# Altium schematic sheet 5V_REG.SchDoc
size A4; SheetNumber: 2; SheetTotal: 7
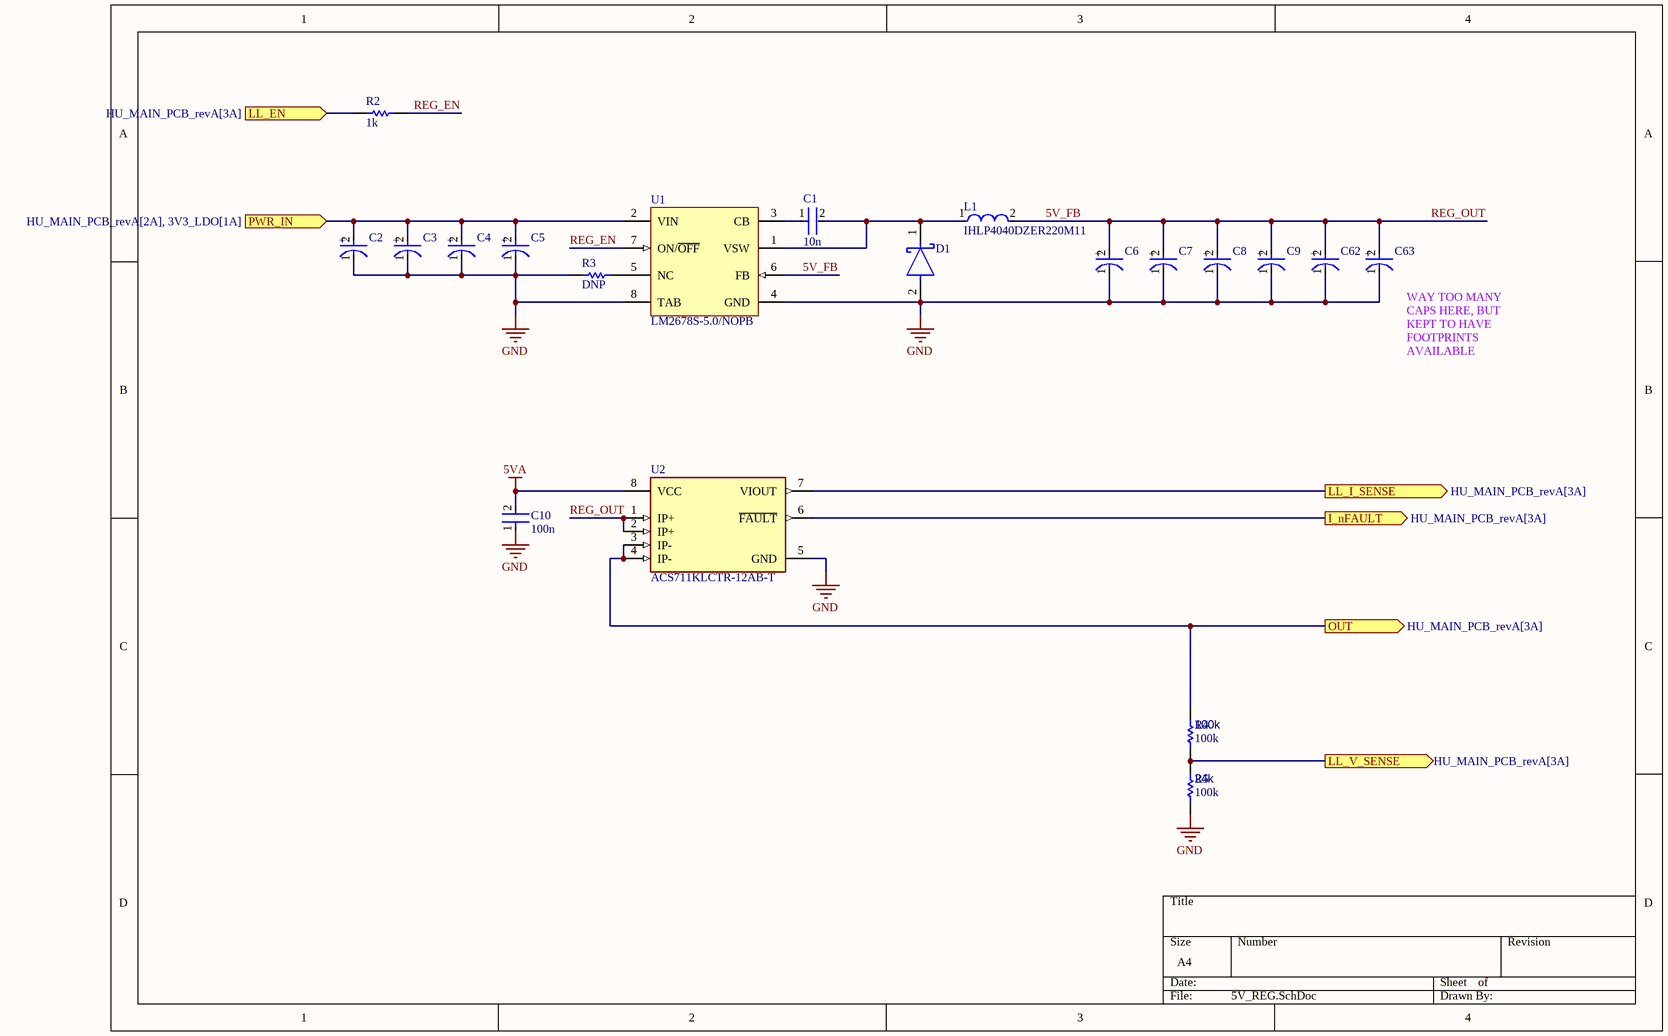
[diagram p0: 5V_REG.SchDoc]

## Parts
C1  10n  [FP-0402-L_1_0_0_05-W_0_5-IPC_A]
C2  TPSE686K025R0125  [FP-TPSE-MFG]  (value not drawn)
C3  TPSE686K025R0125  [FP-TPSE-MFG]  (value not drawn)
C4  TPSE686K025R0125  [FP-TPSE-MFG]  (value not drawn)
C5  TPSE686K025R0125  [FP-TPSE-MFG]  (value not drawn)
C6  TPSE686K025R0125  [FP-TPSE-MFG]  (value not drawn)
C7  TPSE686K025R0125  [FP-TPSE-MFG]  (value not drawn)
C8  TPSE686K025R0125  [FP-TPSE-MFG]  (value not drawn)
C9  TPSE686K025R0125  [FP-TPSE-MFG]  (value not drawn)
C10  100n  [FP-0402-L_1_0_0_05-W_0_5-IPC_A]
C62  TPSE686K025R0125  [FP-TPSE-MFG]  (value not drawn)
C63  TPSE686K025R0125  [FP-TPSE-MFG]  (value not drawn)
D1  B540C-13-F  [FP-SMC-MFG]  (value not drawn)
L1  IHLP4040DZER220M11  [FP-IHLP-4040DZ-FP_3_124x3-MFG]
R2  1k  [R0603B]
R3  DNP  [R0603B]
R4  100k  [R0603B]
R5  100k  value 24k  [R0603B]
U1  LM2678S-5.0/NOPB  [KTW0007B_L]
U2  ACS711KLCTR-12AB-T  [FP-LC-8-IPC_C]

## Ports
I_nFAULT (out, see HU_MAIN_PCB_revA[3A]), LL_EN (in, see HU_MAIN_PCB_revA[3A]), LL_I_SENSE (out, see HU_MAIN_PCB_revA[3A]), LL_V_SENSE (out, see HU_MAIN_PCB_revA[3A]), OUT (out, see HU_MAIN_PCB_revA[3A]), PWR_IN (in, see HU_MAIN_PCB_revA[2A], 3V3_LDO[1A])

## Nets
5VA: C10.2 U2.8(VCC)
GND: C2.1(C) C3.1(C) C4.1(C) C5.1(C) C6.1(C) C7.1(C) C8.1(C) C9.1(C) C10.1 C62.1(C) C63.1(C) D1.2(A) R3.2 R5.1 U1.4(GND) U1.8(TAB) U2.5(GND)
5V_FB: C6.2(A) C7.2(A) C8.2(A) C9.2(A) C62.2(A) C63.2(A) L1.2 U1.6(FB) U2.1(IP+) U2.2(IP+)  [also labelled REG_OUT]
I_nFAULT: U2.6(~{FAULT}) ; port I_nFAULT
LL_EN: R2.2 ; port LL_EN
LL_I_SENSE: U2.7(VIOUT) ; port LL_I_SENSE
LL_V_SENSE: R4.1 R5.2 ; port LL_V_SENSE
OUT: R4.2 U2.3(IP-) U2.4(IP-) ; port OUT
PWR_IN: C2.2(A) C3.2(A) C4.2(A) C5.2(A) U1.2(VIN) ; port PWR_IN
REG_EN: R2.1 U1.7(ON/~{OFF})
NetC1_1: C1.1 U1.3(CB)
NetC1_2: C1.2 D1.1(C) L1.1 U1.1(VSW)
NetR3_1: R3.1 U1.5(NC)

## Notes on the sheet
- (near C63) WAY TOO MANY CAPS HERE, BUT KEPT TO HAVE FOOTPRINTS AVAILABLE
- (in symbol CMP-04424-000178-1) +

## Library data of the parts
C1 C10 = CMP-001-00058-1: LARGE PADS, 0402 CAP, CHANGE COMMENT TO MATCH REAL P/N; Capacitor Type: Ceramic; Min Operating Temperature: -55°C; Mounting Technology: Surface Mount; Pins: 2; Case/Package: 0402; RoHS Compliant: Yes; Max Operating Temperature: 85°C
C2-C9 C62 C63 = CMP-04424-000178-1: CAP TANT 68UF 10% 25V 2917; Leakage Current: 17uA; Dielectric Material: Tantalum; Dissipation Factor: 6%; Ripple Current: 460uA; Polarity: Polar; ESR (Equivalent Series Resistance): 125mR; Mount: Surface Mount; Voltage Rating: 25V; Min Operating Temperature: -55°C; Case Code (Imperial): 2917; RoHS Compliant: Yes; Depth: 4.3mm; Lead Free: Lead Free; Number of Pins: 2; Width: 4.3mm; Series: TPS; Radiation Hardening: No; Height - Seated (Max): 0.169inch; Capacitance: 68uF; Case Code (Metric): 7343; Length: 7.3mm; Max Operating Temperature: 125°C; Packaging: Tape and Reel; Case/Package: 2917; Package Quantity: 1; Features: General Purpose; Voltage: 25V; REACH SVHC: No SVHC; Tolerance: 10%; Voltage Rating (DC): 25V; Height: 4.1mm; Termination: SMD/SMT
D1 = CMP-2000-05097-3: DIODE SCHOTTKY 40V 5A SMC; Manufacturer: Diodes Inc.; Automotive Grade: NA; Peak Reverse Current: 0.5mA; Value: 300pF; Max Junction Temp: +150°C; Max Surge Forward Current: 100A; Standoff Height: 0.1mm; Digikey Description: DIODE SCHOTTKY 40V 5A SMC; Temperature Range Low: -55°C; Manufacturer Part Number: B540C-13-F; Octopart: https://octopart.com/b540c-13-f-diodes+inc.-325873; Lead Free: Yes; Reverse Voltage: 40V; RoHS: TRUE; Category: Diode; Mouser Description: Diode: Schottky rectifying; SMD; 40V; 5A; SMC; Package: reel, tape; ComponentLink2Description: Datasheet; Temperature Range High: +150°C; Automotive: No; Footprint Url: https://www.diodes.com/assets/Package-Files/SMC.pdf; Device Class L3: Schottky Diodes; Height: 2.5mm; Forward Current: 5A; Temperature: -55°C to +150°C; Package: SMC; ComponentLink2URL: https://www.diodes.com/assets/Datasheets/ds13012.pdf; Device Class L2: Diodes; Max Repetitive Reverse Voltage: 40V; Device Class L1: Discrete Semiconductors; Capacitance: 300pF
L1 = CMP-02424-000785-1: Commercial Inductors, Low DCR Series 22uH 5A 66mΩ 20%; Shielding: Shielded; Max DC Current: 4.5A; Test Frequency: 100kHz; DC Resistance (DCR): 66mR; Self Resonant Frequency: 1MHz; Core Material: Metal; Series: IHLP-4040DZ-11; Min Operating Temperature: -55°C; Rated Current-Max: 5A; Current Rating: 5A; Military Standard: Not; Depth: 10.3mm; Height - Seated (Max): 0.157inch; Contact Plating: Tin; Termination: SMD/SMT; Length: 0.43inch; Package Quantity: 1; Width: 0.405inch; Inductance Tolerance: 20%; Tolerance: 20%; Height: 4mm; RMS Current (Irms): 5A; Saturation Current: 4.5A; Inductance: 22uH; Mount: Surface Mount; Max Operating Temperature: 125°C; Case/Package: 4040; Packaging: Tape and Reel; Radiation Hardening: No; RoHS Compliant: Yes; Lead Free: Lead Free
R2 R4 R5 = CMP-009-00002-14: Resistor
  R2: Value: 1k
  R4: Value: 100k
R3 = CMP-009-00002-14: Resistor; Value: 1k
U1 = CMP-0069-00189-3: SIMPLE SWITCHER® High Efficiency 5A Step-Down Voltage Regulator, 7-pin TO-263, Pb-Free; Manufacturer: Texas Instruments; PackageTopMarking: NSUZXYTTE#*LM2678*S-5.0; PowerWise: N; PackageReference: KTW0007B; RoHS: Y; ComponentLink1URL: http://www.ti.com/general/docs/lit/getliterature.tsp?genericPartNumber=LM2678&fileType=pdf; ComponentLink1Description: Datasheet URL; PackageDescription: TO-263, Molded, .400 x .390 x .180in Body, 7 Lead, .050in Pitch, Surface Mount; Code_JEDEC: MO-169-AC; PinCount: 7; CompType: Switcher
U2 = CMP-1557-00012-2: SENSOR CURRENT HALL 12.5A AC/DC; Number of Channels: 1; Min Supply Voltage: 3V; Sensitivity: 110mV/A; Response Time: 4.6us; Operating Supply Voltage: 3.3V; Max Supply Voltage: 5.5V; Max Supply Current: 5.5mA; Bandwidth: 100kHz; Linearity: 1%; Quiescent Current: 4mA; Accuracy: 5%; Polarity: Bidirectional; Case/Package: SOIC; Packaging: Tape and Reel; Number of Pins: 8; Width: 3.9mm; Frequency: 100kHz; -3db Bandwidth: 100kHz; REACH SVHC: No SVHC; Series: -; Height: 1.5mm; Package Quantity: 1; Min Operating Temperature: -40°C; Max Operating Temperature: 125°C; Current Sensing: 12.5A; RoHS Compliant: Yes; Length: 4.9mm